# EAGLE design CanBus (EAGLE 7.4.0)

## Sheet 1 of 2
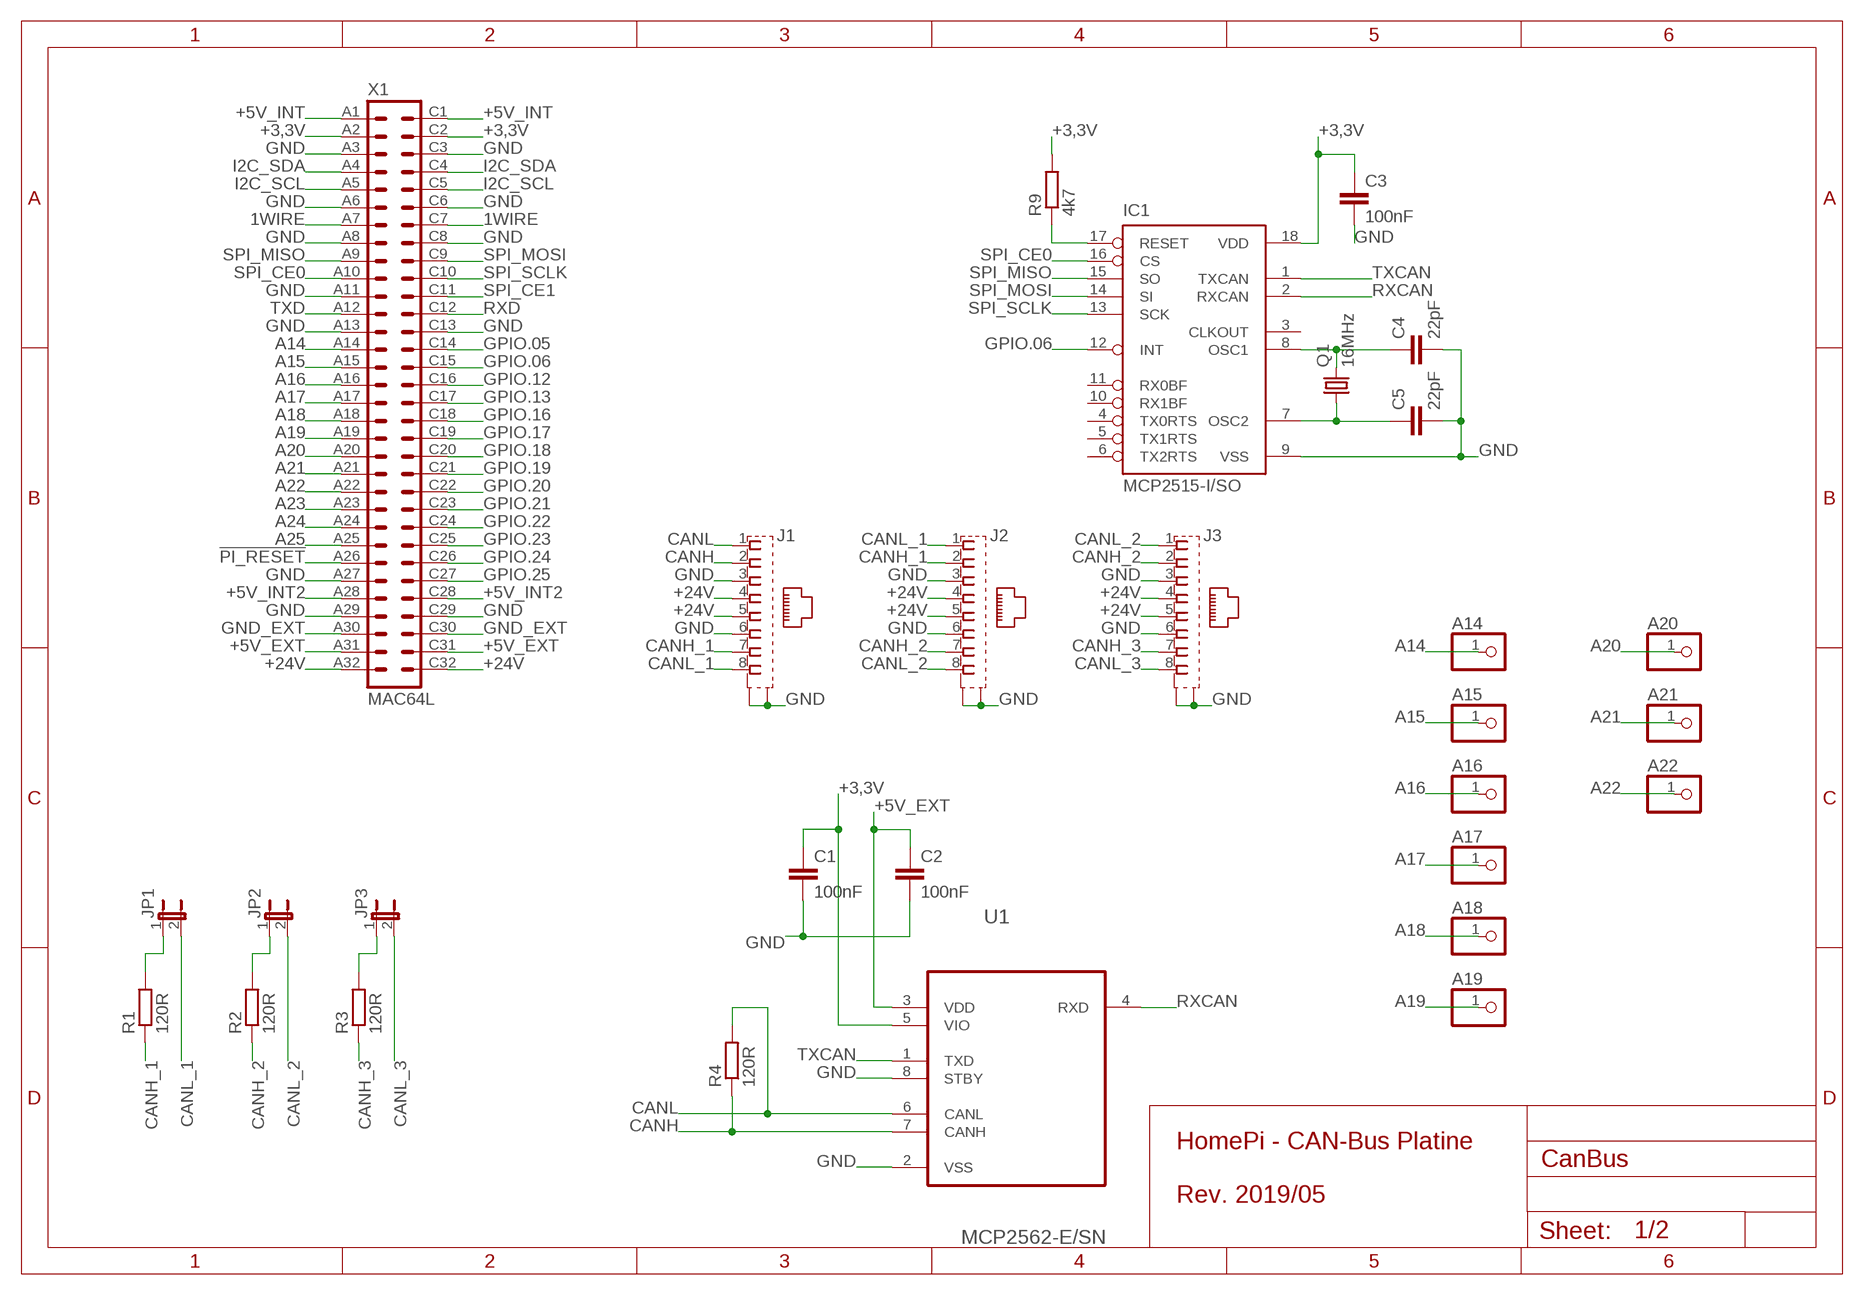
[diagram p0: schematic, sheet 1]

### Parts
A14  PINHD-1X1  [1X01]
A15  PINHD-1X1  [1X01]
A16  PINHD-1X1  [1X01]
A17  PINHD-1X1  [1X01]
A18  PINHD-1X1  [1X01]
A19  PINHD-1X1  [1X01]
A20  PINHD-1X1  [1X01]
A21  PINHD-1X1  [1X01]
A22  PINHD-1X1  [1X01]
C1  100nF  C-EUC1206  [C1206]
C2  100nF  C-EUC1206  [C1206]
C3  100nF  C-EUC1206  [C1206]
C4  22pF  C-EUC1206  [C1206]
C5  22pF  C-EUC1206  [C1206]
IC1  MCP2515-I/SO  [SO18L]
J1  555141-1  [MEBP_8-8G]
J2  555141-1  [MEBP_8-8G]
J3  555141-1  [MEBP_8-8G]
JP1  JP1E  [JP1]
JP2  JP1E  [JP1]
JP3  JP1E  [JP1]
Q1  16MHz  CRYSTALHC49UP  [HC49UP]
R1  120R  R-EU_R1206  [R1206]
R2  120R  R-EU_R1206  [R1206]
R3  120R  R-EU_R1206  [R1206]
R4  120R  R-EU_R1206  [R1206]
R9  4k7  R-EU_R1206  [R1206]
U1  MCP2562-E/SN  [SO08]
X1  MAC64L  [MAC64L]

### Nets
1WIRE: X1.A7 X1.C7
!PI_RESET: X1.A26 ; also sheet 2
+3,3V: C1.1 C3.1 IC1.18(VDD) R9.2 U1.5(VIO) X1.A2 X1.C2 ; also sheet 2
+5V_EXT: C2.1 U1.3(VDD) X1.A31 X1.C31 ; also sheet 2
+5V_INT: X1.A1 X1.C1
+5V_INT2: X1.A28 X1.C28
+24V [24V]: J1.4 J1.5 J2.4 J2.5 J3.4 J3.5 X1.A32 X1.C32
A14: A14.1 X1.A14
A15: A15.1 X1.A15
A16: A16.1 X1.A16
A17: A17.1 X1.A17
A18: A18.1 X1.A18
A19: A19.1 X1.A19
A20: A20.1 X1.A20
A21: A21.1 X1.A21
A22: A22.1 X1.A22
A23: X1.A23
A24: X1.A24
A25: X1.A25
CANH: J1.2 R4.1 U1.7(CANH) ; also sheet 2
CANH_1: J1.7 J2.2 R1.1
CANH_2: J2.7 J3.2 R2.1
CANH_3: J3.7 R3.1
CANL: J1.1 R4.2 U1.6(CANL) ; also sheet 2
CANL_1: J1.8 J2.1 JP1.2
CANL_2: J2.8 J3.1 JP2.2
CANL_3: J3.8 JP3.2
GND: C1.2 C2.2 C3.2 C4.2 C5.2 IC1.9(VSS) J1.3 J1.6 J1.G1(S1) J1.G2(S2) J2.3 J2.6 J2.G1(S1) J2.G2(S2) J3.3 J3.6 J3.G1(S1) J3.G2(S2) U1.2(VSS) U1.8(STBY) X1.A3 X1.A6 X1.A8 X1.A11 X1.A13 X1.A27 X1.A29 X1.C3 X1.C6 X1.C8 X1.C13 X1.C29 ; also sheet 2
GND_EXT: X1.A30 X1.C30
GPIO.05: X1.C14
GPIO.06: IC1.12(INT) X1.C15
GPIO.12: X1.C16
GPIO.13: X1.C17
GPIO.16: X1.C18
GPIO.17: X1.C19
GPIO.18: X1.C20
GPIO.19: X1.C21
GPIO.20: X1.C22
GPIO.21: X1.C23
GPIO.22: X1.C24
GPIO.23: X1.C25
GPIO.24: X1.C26
GPIO.25: X1.C27
I2C_SCL: X1.A5 X1.C5
I2C_SDA: X1.A4 X1.C4
N$1: C4.1 IC1.8(OSC1) Q1.2
N$2: IC1.17(RESET) R9.1
N$3: JP2.1 R2.2
N$4: C5.1 IC1.7(OSC2) Q1.1
N$8: JP1.1 R1.2
N$12: JP3.1 R3.2
RXCAN: IC1.2(RXCAN) U1.4(RXD)
RXD: X1.C12
SPI_CE0: IC1.16(CS) X1.A10
SPI_CE1: X1.C11
SPI_MISO: IC1.15(SO) X1.A9
SPI_MOSI: IC1.14(SI) X1.C9
SPI_SCLK: IC1.13(SCK) X1.C10
TXCAN: IC1.1(TXCAN) U1.1(TXD)
TXD: X1.A12
Unconnected: IC1.3(CLKOUT) IC1.4(TX0RTS) IC1.5(TX1RTS) IC1.6(TX2RTS) IC1.10(RX1BF) IC1.11(RX0BF)

### Notes on the sheet
- HomePi - CAN-Bus Platine
  
  Rev. 2019/05

## Sheet 2 of 2
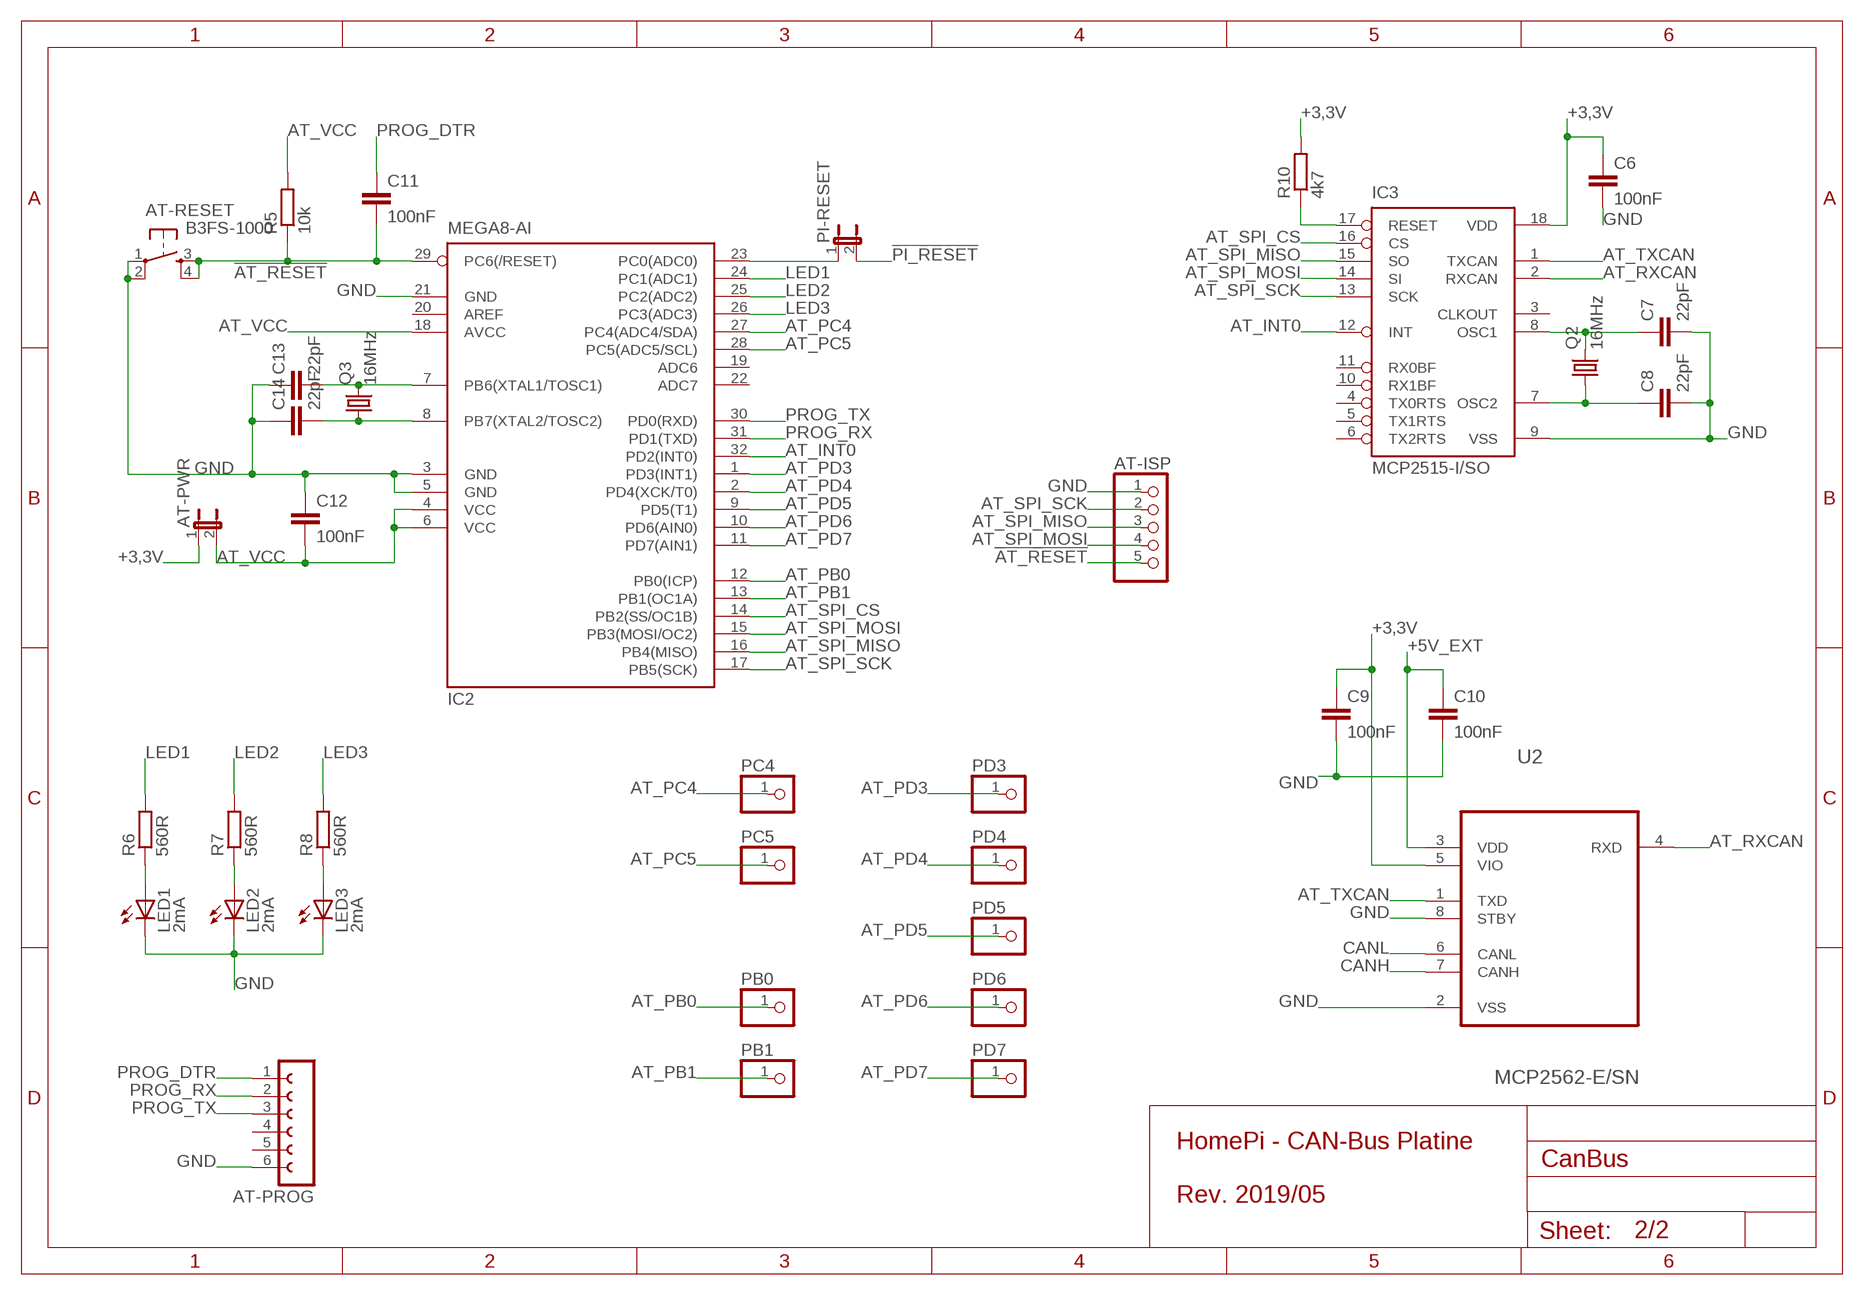
[diagram p1: schematic, sheet 2]

### Parts
AT-ISP  PINHD-1X5  [1X05]
AT-PROG  FE06W  [FE06W]
AT-PWR  JP1E  [JP1]
AT-RESET  B3FS-1000  [B3FS-1000]
C6  100nF  C-EUC1206  [C1206]
C7  22pF  C-EUC1206  [C1206]
C8  22pF  C-EUC1206  [C1206]
C9  100nF  C-EUC1206  [C1206]
C10  100nF  C-EUC1206  [C1206]
C11  100nF  C-EUC1206  [C1206]
C12  100nF  C-EUC1206  [C1206]
C13  22pF  C-EUC1206  [C1206]
C14  22pF  C-EUC1206  [C1206]
IC2  MEGA8-AI  [TQFP32-08]
IC3  MCP2515-I/SO  [SO18L]
LED1  2mA  LED3MM  [LED3MM]
LED2  2mA  LED3MM  [LED3MM]
LED3  2mA  LED3MM  [LED3MM]
PB0  PINHD-1X1  [1X01]
PB1  PINHD-1X1  [1X01]
PC4  PINHD-1X1  [1X01]
PC5  PINHD-1X1  [1X01]
PD3  PINHD-1X1  [1X01]
PD4  PINHD-1X1  [1X01]
PD5  PINHD-1X1  [1X01]
PD6  PINHD-1X1  [1X01]
PD7  PINHD-1X1  [1X01]
PI-RESET  JP1E  [JP1]
Q2  16MHz  CRYSTALHC49UP  [HC49UP]
Q3  16MHz  CRYSTALHC49UP  [HC49UP]
R5  10k  R-EU_R1206  [R1206]
R6  560R  R-EU_R1206  [R1206]
R7  560R  R-EU_R1206  [R1206]
R8  560R  R-EU_R1206  [R1206]
R10  4k7  R-EU_R1206  [R1206]
U2  MCP2562-E/SN  [SO08]

### Nets
!AT_RESET: AT-ISP.5 AT-RESET.3(S) AT-RESET.4(S1) C11.2 IC2.29(PC6(/RESET)) R5.1
!PI_RESET: PI-RESET.2 ; also sheet 1
+3,3V: AT-PWR.1 C6.1 C9.1 IC3.18(VDD) R10.2 U2.5(VIO) ; also sheet 1
+5V_EXT: C10.1 U2.3(VDD) ; also sheet 1
AT_INT0: IC2.32(PD2(INT0)) IC3.12(INT)
AT_PB0: IC2.12(PB0(ICP)) PB0.1
AT_PB1: IC2.13(PB1(OC1A)) PB1.1
AT_PC4: IC2.27(PC4(ADC4/SDA)) PC4.1
AT_PC5: IC2.28(PC5(ADC5/SCL)) PC5.1
AT_PD3: IC2.1(PD3(INT1)) PD3.1
AT_PD4: IC2.2(PD4(XCK/T0)) PD4.1
AT_PD5: IC2.9(PD5(T1)) PD5.1
AT_PD6: IC2.10(PD6(AIN0)) PD6.1
AT_PD7: IC2.11(PD7(AIN1)) PD7.1
AT_RXCAN: IC3.2(RXCAN) U2.4(RXD)
AT_SPI_CS: IC2.14(PB2(SS/OC1B)) IC3.16(CS)
AT_SPI_MISO: AT-ISP.3 IC2.16(PB4(MISO)) IC3.15(SO)
AT_SPI_MOSI: AT-ISP.4 IC2.15(PB3(MOSI/OC2)) IC3.14(SI)
AT_SPI_SCK: AT-ISP.2 IC2.17(PB5(SCK)) IC3.13(SCK)
AT_TXCAN: IC3.1(TXCAN) U2.1(TXD)
AT_VCC: AT-PWR.2 C12.2 IC2.4(VCC) IC2.6(VCC) IC2.18(AVCC) R5.2
CANH: U2.7(CANH) ; also sheet 1
CANL: U2.6(CANL) ; also sheet 1
GND: AT-ISP.1 AT-PROG.6 AT-RESET.1(P) AT-RESET.2(P1) C6.2 C7.2 C8.2 C9.2 C10.2 C12.1 C13.1 C14.1 IC2.3(GND) IC2.5(GND) IC2.21(GND) IC3.9(VSS) LED1.K(C) LED2.K(C) LED3.K(C) U2.2(VSS) U2.8(STBY) ; also sheet 1
LED1: IC2.24(PC1(ADC1)) R6.2
LED2: IC2.25(PC2(ADC2)) R7.2
LED3: IC2.26(PC3(ADC3)) R8.2
N$5: IC3.17(RESET) R10.1
N$6: C7.1 IC3.8(OSC1) Q2.2
N$7: C8.1 IC3.7(OSC2) Q2.1
N$9: IC2.23(PC0(ADC0)) PI-RESET.1
N$10: C13.2 IC2.7(PB6(XTAL1/TOSC1)) Q3.2
N$11: C14.2 IC2.8(PB7(XTAL2/TOSC2)) Q3.1
N$14: LED1.A R6.1
N$15: LED2.A R7.1
N$19: LED3.A R8.1
PROG_DTR: AT-PROG.1 C11.1
PROG_RX: AT-PROG.2 IC2.31(PD1(TXD))
PROG_TX: AT-PROG.3 IC2.30(PD0(RXD))
Unconnected: AT-PROG.4 AT-PROG.5 IC2.19(ADC6) IC2.20(AREF) IC2.22(ADC7) IC3.3(CLKOUT) IC3.4(TX0RTS) IC3.5(TX1RTS) IC3.6(TX2RTS) IC3.10(RX1BF) IC3.11(RX0BF)

### Notes on the sheet
- HomePi - CAN-Bus Platine
  
  Rev. 2019/05

## Library data of the parts
A14-A22 PB0 PB1 PC4 PC5 PD3-PD7 = pinhead:PINHD-1X1: PIN HEADER
AT-ISP = pinhead:PINHD-1X5: PIN HEADER
AT-PROG = con-lsta:FE06W: FEMALE HEADER; OC_FARNELL: unknown; OC_NEWARK: unknown
AT-PWR JP1-JP3 PI-RESET = jumper:JP1E: JUMPER
AT-RESET = b3fs-1000:B3FS-1000
C1-C14 = rcl:C-EU: CAPACITOR, European symbol
IC1 IC3 = mcp2515_2551_2562:MCP2515
IC2 = atmel:MEGA8: MICROCONTROLLER 8 Kbytes FLASH, 1 kbytes SRAM, 512 bytes EEPROM, USART, 6-channel 10 bit ADC, 2-channel 8 bit ADC Pin compatible with Atmega48, ATMega88, ATMega168 Source: avr.lbr; MPN: ATMEGA8-16AU; OC_FARNELL: 9171371; OC_NEWARK: 73M8863
J1-J3 = mebp_8-8g:555141-1: AMP connector Reichelt Bestell-Nr. MEBP 8-8G
LED1-LED3 = led:LED: LED OSRAM: - CHIPLED LG R971, LG N971, LY N971, LG Q971, LY Q971, LO R971, LY R971 LH N974, LH R974 LS Q976, LO Q976, LY Q976 LO Q996 - Hyper CHIPLED LW Q18S LB Q993, LB Q99A, LB R99A - SideLED LS A670, LO A670, LY A670, LG A670, LP A670 LB A673, LV A673, LT A673, LW A673 LH A674 LY A675 LS A676, LA A676, LO A676, LY A676, LW A676 LS A679, LY A679, LG A679 - Hyper Micro SIDELED® LS Y876, LA Y876, LO Y876, LY Y876 LT Y87S - SmartLED LW L88C, LW L88S LB L89C, LB L89S, LG L890 LS L89K, LO L89K, LY L89K LS L896, LA L896, LO L896, LY L896 - TOPLED LS T670, LO T670, LY T670, LG T670, LP T670 LSG T670, LSP T670, LSY T670, LOP T670, LYG T670 LG T671, LOG T671, LSG T671 LB T673, LV T673, LT T673, LW T673 LH T674 LS T676, LA T676, LO T676, LY T676, LB T676, LH T676, LSB T676, LW T676 LB T67C, LV T67C, LT T67C, LS T67K, LO T67K, LY T67K, LW E67C LS E67B, LA E67B, LO E67B, LY E67B, LB E67C, LV E67C, LT E67C LW T67C LS T679, LY T679, LG T679 LS T770, LO T770, LY T770, LG T770, LP T770 LB T773, LV T773, LT T773, LW T773 LH T774 LS E675, LA E675, LY E675, LS T675 LS T776, LA T776, LO T776, LY T776, LB T776 LHGB T686 LT T68C, LB T68C - Hyper Mini TOPLED® LB M676 - Mini TOPLED Santana® LG M470 LS M47K, LO M47K, LY M47K Source: http://www.osram.convergy.de LUXEON: - LUMILED® LXK2-PW12-R00, LXK2-PW12-S00, LXK2-PW14-U00, LXK2-PW14-V00 LXK2-PM12-R00, LXK2-PM12-S00, LXK2-PM14-U00 LXK2-PE12-Q00, LXK2-PE12-R00, LXK2-PE12-S00, LXK2-PE14-T00, LXK2-PE14-U00 LXK2-PB12-K00, LXK2-PB12-L00, LXK2-PB12-M00, LXK2-PB14-N00, LXK2-PB14-P00, LXK2-PB14-Q00 LXK2-PR12-L00, LXK2-PR12-M00, LXK2-PR14-Q00, LXK2-PR14-R00 LXK2-PD12-Q00, LXK2-PD12-R00, LXK2-PD12-S00 LXK2-PH12-R00, LXK2-PH12-S00 LXK2-PL12-P00, LXK2-PL12-Q00, LXK2-PL12-R00 Source: www.luxeon.com KINGBRIGHT: KA-3528ASYC Source: www.kingbright.com
Q1-Q3 = crystal:CRYSTAL: CRYSTAL; OC_FARNELL: unknown; OC_NEWARK: unknown
R1-R10 = rcl:R-EU_: RESISTOR, European symbol
U1 U2 = mcp2515_2551_2562:MCP2562: High-Speed CAN Transceiver,DIP-8
X1 = con-vg:MAC64L: CONNECTOR male, 64 pins, block, type C, rows AC, grid 5.08 mm

## Net classes
1 24V: width 0.813 mm, clearance 0.406 mm

## Board
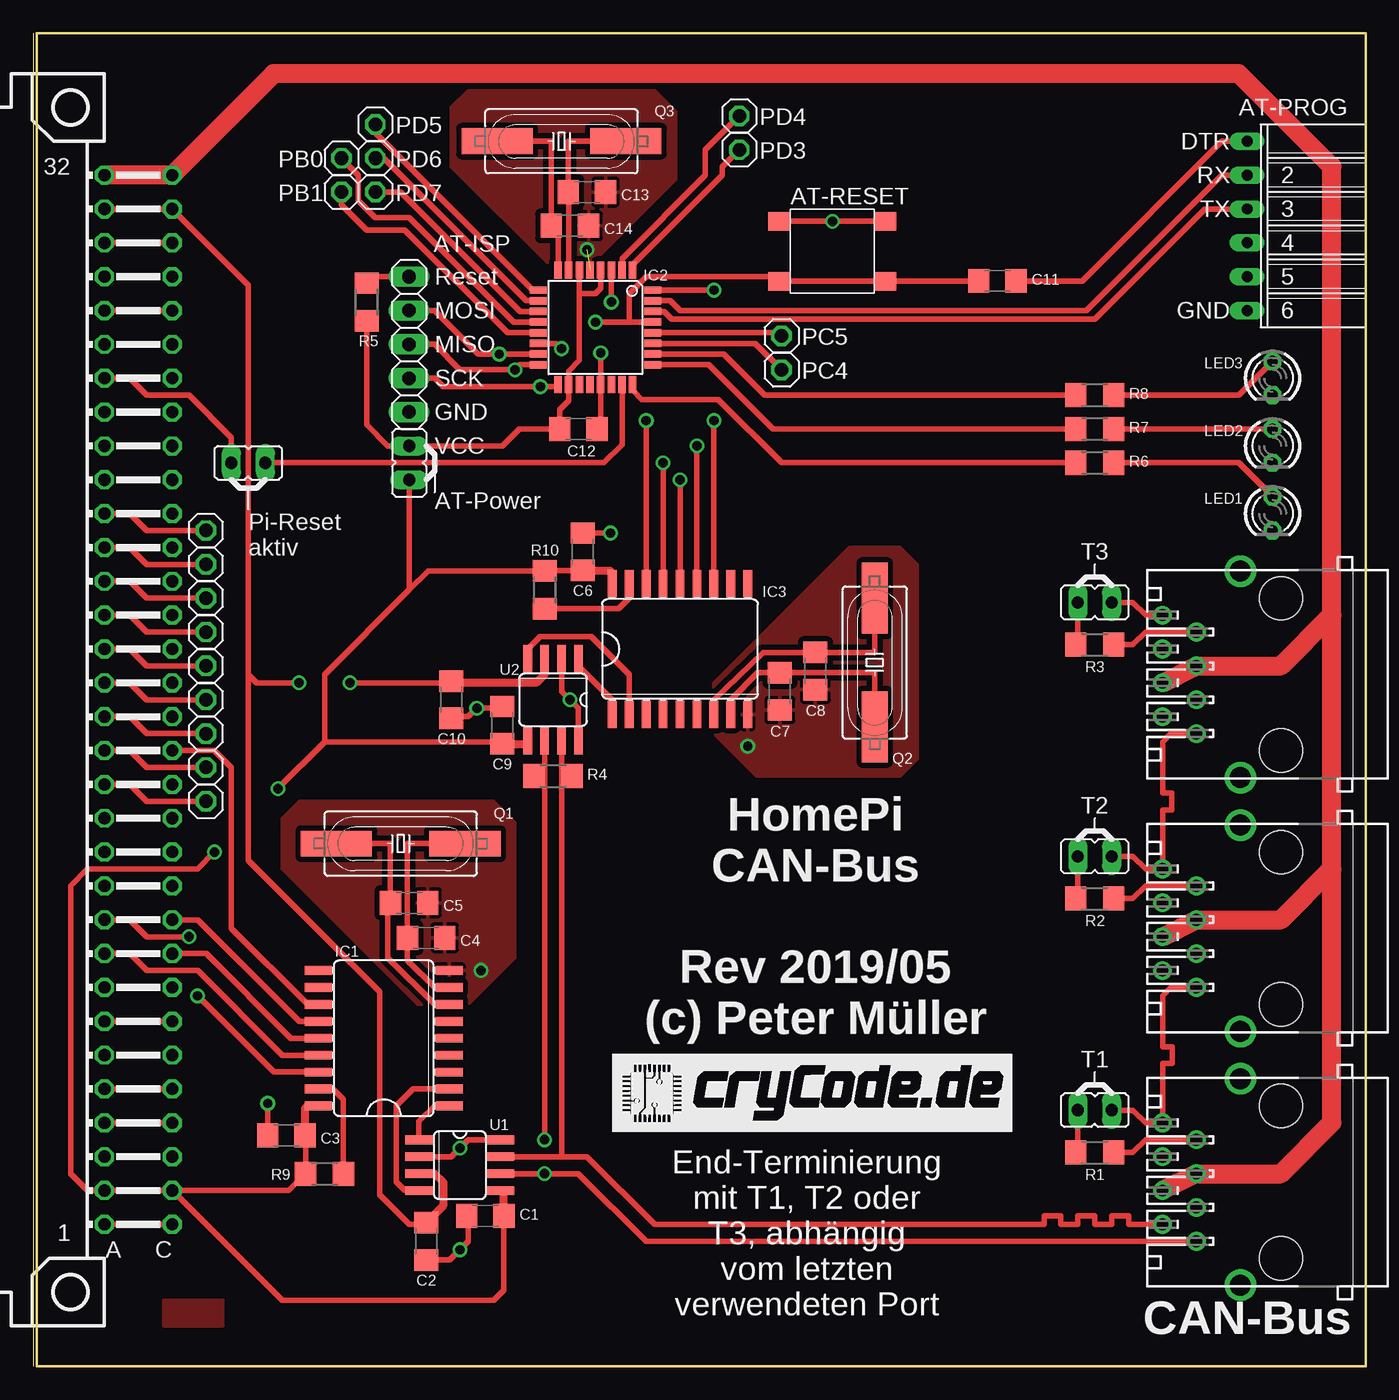
[diagram p2: board, top side]
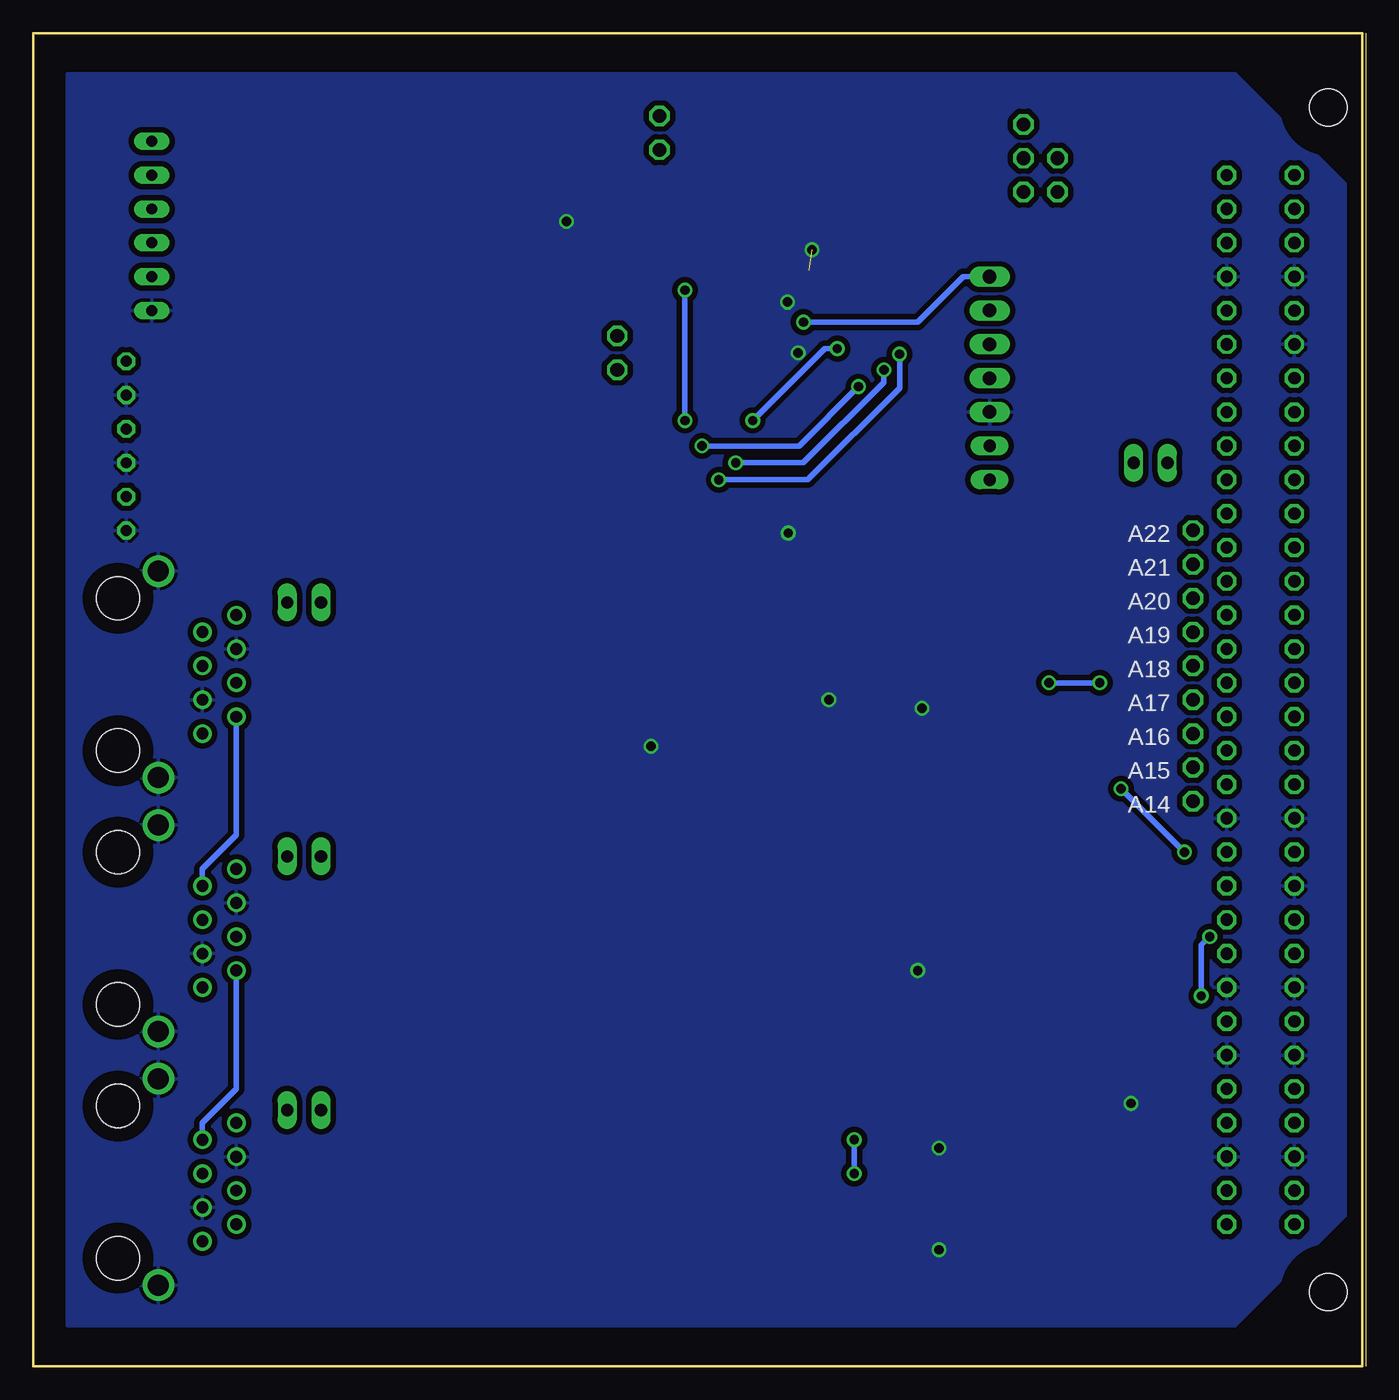
[diagram p3: board, bottom side, seen from below]

Size 99.69 x 100 mm. Coordinates in mm from the lower left corner, seen from the top.
Outline: 0,0 99.69,0 99.69,100 0,100 0,0
Copper layers (1*16): Top 0.035mm / dielectric 1.5mm / Bottom 0.035mm
Design rules "allpcb2": minimum track width 8mil, minimum drill 0.5mm, track to track 8mil, track to pad 8mil, pad to pad 8mil, via to via 8mil, smd to smd 6mil, copper to edge 40mil, drill to drill 8mil, minimum pad ring 10mil, minimum via ring 8mil, stop-mask expansion 0.1mm, vias tented up to drill 0mil, thermal gap 10mil

### Footprints (pad centres in the part's own frame; a part is rotated, then mirrored left to right if it is on the bottom)
1X01 = drill 1.016 octagon: 1 0,0
1X05 = drill 1.016 long: 1 -5.08,0; 2 -2.54,0; 3 0,0; 4 2.54,0; 5 5.08,0
FE06W = drill 0.813 long: 1 -6.35,0; 2 -3.81,0; 3 -1.27,0; 4 1.27,0; 5 3.81,0; 6 6.35,0
JP1 = drill 0.914 long: 1 0,-1.27; 2 0,1.27
B3FS-1000 = smd 1.6 x 1.4: 1 4,-2.25; 2 -4,-2.25; 3 4,2.25; 4 -4,2.25
C1206 = smd 1.6 x 1.8: 1 -1.4,0; 2 1.4,0
SO18L = smd 0.66 x 2.032: 1 -5.08,-4.902; 2 -3.81,-4.902; 3 -2.54,-4.902; 4 -1.27,-4.902; 5 0,-4.902; 6 1.27,-4.902; 7 2.54,-4.902; 8 3.81,-4.902; 9 5.08,-4.902; 10 5.08,4.902; 11 3.81,4.902; 12 2.54,4.902; 13 1.27,4.902; 14 0,4.902; 15 -1.27,4.902; 16 -2.54,4.902; 17 -3.81,4.902; 18 -5.08,4.902
TQFP32-08 = smd 1.27 x 0.559: 1 -4.293,2.8; 2 -4.293,2; 3 -4.293,1.2; 4 -4.293,0.4; 5 -4.293,-0.4; 6 -4.293,-1.2; 7 -4.293,-2; 8 -4.293,-2.8; 17 4.293,-2.8; 18 4.293,-2; 19 4.293,-1.2; 20 4.293,-0.4; 21 4.293,0.4; 22 4.293,1.2; 23 4.293,2; 24 4.293,2.8 | smd 0.559 x 1.27: 9 -2.8,-4.293; 10 -2,-4.293; 11 -1.2,-4.293; 12 -0.4,-4.293; 13 0.4,-4.293; 14 1.2,-4.293; 15 2,-4.293; 16 2.8,-4.293; 25 2.8,4.293; 26 2,4.293; 27 1.2,4.293; 28 0.4,4.293; 29 -0.4,4.293; 30 -1.2,4.293; 31 -2,4.293; 32 -2.8,4.293
MEBP_8-8G = drill 0.889: 1 -4.445,6.35; 2 -3.175,8.89; 3 -1.905,6.35; 4 -0.635,8.89; 5 0.635,6.35; 6 1.905,8.89; 7 3.175,6.35; 8 4.445,8.89 | drill 1.575 pad 2.184: G1 -7.745,3.05; G2 7.745,3.05 | hole 3.251: -5.715,0; 5.715,0
LED3MM = drill 0.813 octagon: A -1.27,0; K 1.27,0
HC49UP = smd 5.334 x 1.93: 1 -4.826,0; 2 4.826,0
R1206 = smd 1.6 x 1.803: 1 -1.422,0; 2 1.422,0
SO08 = smd 0.66 x 2.032: 1 -1.905,-3.073; 2 -0.635,-3.073; 3 0.635,-3.073; 4 1.905,-3.073; 5 1.905,3.073; 6 0.635,3.073; 7 -0.635,3.073; 8 -1.905,3.073
MAC64L = drill 0.914 octagon: A1 -2.54,39.37; A2 -2.54,36.83; A3 -2.54,34.29; A4 -2.54,31.75; A5 -2.54,29.21; A6 -2.54,26.67; A7 -2.54,24.13; A8 -2.54,21.59; A9 -2.54,19.05; A10 -2.54,16.51; A11 -2.54,13.97; A12 -2.54,11.43; A13 -2.54,8.89; A14 -2.54,6.35; A15 -2.54,3.81; A16 -2.54,1.27; A17 -2.54,-1.27; A18 -2.54,-3.81; A19 -2.54,-6.35; A20 -2.54,-8.89; A21 -2.54,-11.43; A22 -2.54,-13.97; A23 -2.54,-16.51; A24 -2.54,-19.05; A25 -2.54,-21.59; A26 -2.54,-24.13; A27 -2.54,-26.67; A28 -2.54,-29.21; A29 -2.54,-31.75; A30 -2.54,-34.29; A31 -2.54,-36.83; A32 -2.54,-39.37; C1 -7.62,39.37; C2 -7.62,36.83; C3 -7.62,34.29; C4 -7.62,31.75; C5 -7.62,29.21; C6 -7.62,26.67; C7 -7.62,24.13; C8 -7.62,21.59; C9 -7.62,19.05; C10 -7.62,16.51; C11 -7.62,13.97; C12 -7.62,11.43; C13 -7.62,8.89; C14 -7.62,6.35; C15 -7.62,3.81; C16 -7.62,1.27; C17 -7.62,-1.27; C18 -7.62,-3.81; C19 -7.62,-6.35; C20 -7.62,-8.89; C21 -7.62,-11.43; C22 -7.62,-13.97; C23 -7.62,-16.51; C24 -7.62,-19.05; C25 -7.62,-21.59; C26 -7.62,-24.13; C27 -7.62,-26.67; C28 -7.62,-29.21; C29 -7.62,-31.75; C30 -7.62,-34.29; C31 -7.62,-36.83; C32 -7.62,-39.37 | hole 2.794: 0,44.45; 0,-44.45

### Placement (x,y rotation side)
A14  12.7,42.38 180 top
A15  12.7,44.92 180 top
A16  12.7,47.46 180 top
A17  12.7,50 180 top
A18  12.7,52.54 180 top
A19  12.7,55.08 180 top
A20  12.7,57.62 180 top
A21  12.7,60.16 180 top
A22  12.7,62.7 180 top
AT-ISP  27.94,76.67 90 top
AT-PROG  90.81,85.56 270 top
AT-PWR  27.94,67.78 0 top
AT-RESET  59.69,83.66 180 top
C1  33.66,11.27 180 top
C2  29.21,9.36 270 top
C3  18.73,17.3 180 top
C4  29.21,32.13 0 top
C5  27.94,34.76 0 top
C6  40.96,61.11 90 top
C7  55.75,50.63 270 top
C8  58.42,52.16 270 top
C9  34.92,48.09 90 top
C10  31.11,50 270 top
C11  72.07,81.43 180 top
C12  40.64,70.32 180 top
C13  41.27,88.1 180 top
C14  40.01,85.56 180 top
IC1  26.04,24.6 90 top
IC2  41.91,77.94 270 top
IC3  48.26,53.81 0 top
J1  93.34,13.81 90 top
J2  93.34,32.85 90 top
J3  93.34,51.91 90 top
JP1  79.38,19.2 270 top
JP2  79.38,38.25 270 top
JP3  79.38,57.3 270 top
LED1  92.71,63.97 270 top
LED2  92.71,69.05 270 top
LED3  92.71,74.13 270 top
PB0  22.86,90.64 0 top
PB1  22.86,88.1 0 top
PC4  55.88,74.77 0 top
PC5  55.88,77.3 0 top
PD3  52.7,91.28 0 top
PD4  52.7,93.81 0 top
PD5  25.4,93.18 0 top
PD6  25.4,90.64 0 top
PD7  25.4,88.1 0 top
PI-RESET  15.88,67.78 90 top
Q1  27.3,39.2 0 top
Q2  62.87,52.79 270 top
Q3  39.37,91.91 0 top
R1  79.38,16.03 180 top
R2  79.38,35.08 180 top
R3  79.38,54.13 180 top
R4  38.73,44.28 180 top
R5  24.77,79.84 270 top
R6  79.38,67.78 180 top
R7  79.38,70.32 180 top
R8  79.38,72.86 180 top
R9  21.59,14.44 180 top
R10  38.1,58.25 90 top
U1  31.75,15.08 270 top
U2  38.73,50 180 top
U$1  [30MM]  43.18,17.61 0 top
X1  2.54,50 180 top

### Tracks (layer width: path | path; a pad name or v marks a point on that pad's centre or on a via)
1WIRE
  Top 0.406: X1.A7 X1.C7
!AT_RESET  (via drill 0.7)
  Top 0.406: IC2.29 44.45,78.34 | 44.45,78.34 v41.91,78.34 | R5.1 24.77,81.75 AT-ISP.5 | 63.66,81.41 AT-RESET.3 55.59,81.41 55.24,81.75 45.72,81.75 44.45,80.48 44.45,78.34 | AT-RESET.4 63.66,81.41 | 63.66,81.41 C11.2
  Bottom 0.406: v41.91,78.34 33.34,78.34 29.93,81.75 AT-ISP.5
!PI_RESET
  Top 0.406: X1.A26 6.99,74.13 8.26,72.86 11.43,72.86 14.61,69.69 PI-RESET.2
+3,3V  (via drill 0.7)
  Top 0.406: X1.C2 X1.A2 3.81,13.17 2.54,14.44 2.54,36.03 3.81,37.3 12.06,37.3 v13.34,38.57 | 36.6,46.7 U2.5 | C9.1 34.92,46.82 21.59,46.82 | C1.1 35.05,5.68 34.29,4.92 18.41,4.92 X1.C2 | 35.05,12.94 U1.5 | X1.C2 18.9,13.17 R9.2 20.17,17.26 C3.1 | 21.59,46.82 v18.1,43.33 | 41.3,59.69 41.27,59.71 C6.1 38.14,59.71 R10.2 29.36,59.68 27.94,58.25 | AT-PWR.1 27.94,58.25 | 21.59,46.82 21.59,51.91 27.94,58.25
  Top 0.61: C9.1 36.6,46.7 | C1.1 35.05,12.94 | C3.1 20.13,19.33 20.32,19.52 IC1.18 | 41.3,59.69 43.01,59.69 43.18,59.52 IC3.18
  Bottom 0.406: v18.1,43.33 v13.34,38.57
+5V_EXT  (via drill 0.7)
  Top 0.406: X1.A31 X1.C31 15.88,81.11 15.88,51.91 | v19.68,51.27 16.51,51.27 15.88,51.91 | 31.25,51.27 C10.1 30.98,51.27 v23.5,51.27 | 15.88,51.91 15.88,37.94 25.72,28.09 25.72,12.85 27.94,10.63 29.08,10.63 C2.1
  Top 0.61: U2.3 38.1,51.91 37.47,51.27 31.25,51.27 | U1.3 29.84,14.44 30.48,13.81 30.48,12.03 C2.1
  Bottom 0.406: v19.68,51.27 v23.5,51.27
+5V_INT
  Top 0.406: X1.C1 X1.A1
+5V_INT2
  Top 0.406: X1.C28 X1.A28
+24V
  Top 1.422: J1.4 J1.5 93.34,14.44 97.16,18.25 97.16,37.3 | X1.A32 X1.C32 17.78,96.99 90.17,96.99 97.16,90 97.16,56.35 | 97.16,37.3 97.16,56.35 | J2.4 J2.5 93.34,33.49 97.16,37.3 | J3.4 J3.5 93.34,52.54 97.16,56.35
A14
  Top 0.406: X1.A14 6.99,43.65 8.26,42.38 A14.1
A15
  Top 0.406: X1.A15 6.99,46.19 8.26,44.92 A15.1
A16
  Top 0.406: X1.A16 6.99,48.73 8.26,47.46 A16.1
A17
  Top 0.406: X1.A17 6.99,51.27 8.26,50 A17.1
A18
  Top 0.406: X1.A18 6.99,53.81 8.26,52.54 A18.1
A19
  Top 0.406: X1.A19 6.99,56.35 8.26,55.08 A19.1
A20
  Top 0.406: X1.A20 6.99,58.89 8.26,57.62 A20.1
A21
  Top 0.406: X1.A21 6.99,61.43 8.26,60.16 A21.1
A22
  Top 0.406: X1.A22 6.99,63.97 8.26,62.7 A22.1
AT_INT0  (via drill 0.7)
  Top 0.406: IC2.32 v50.8,80.74 | IC3.12 v50.8,70.95
  Bottom 0.406: v50.8,70.95 v50.8,80.74
AT_PB0
  Top 0.406: IC2.12 35.8,78.34 27.94,86.19 25.4,86.19 24.13,87.47 24.13,89.37 PB0.1
AT_PB1
  Top 0.406: IC2.13 35.33,77.54 27.62,85.24 24.77,85.24 22.86,87.15 PB1.1
AT_PC4
  Top 0.406: IC2.27 53.91,76.74 PC4.1
AT_PC5
  Top 0.406: IC2.28 55.65,77.54 PC5.1
AT_PD3
  Top 0.406: IC2.1 44.71,82.64 51.44,89.37 51.44,90 PD3.1
AT_PD4
  Top 0.406: IC2.2 43.91,83.11 50.16,89.37 50.16,91.28 PD4.1
AT_PD5
  Top 0.406: IC2.9 37.2,80.74 25.4,92.55 PD5.1
AT_PD6
  Top 0.406: IC2.10 36.73,79.94 26.04,90.64 PD6.1
AT_PD7
  Top 0.406: IC2.11 36.27,79.14 27.3,88.1 PD7.1
AT_RXCAN
  Top 0.406: IC3.2 44.45,51.91 41.59,54.76 37.78,54.76 36.83,53.81 U2.4
AT_SPI_CS  (via drill 0.7)
  Top 0.406: IC3.16 v45.72,70.95 | IC2.14 38.98,76.74 v39.37,76.35
  Bottom 0.406: v39.37,76.35 40.32,76.35 v45.72,70.95
AT_SPI_MISO  (via drill 0.7)
  Top 0.406: IC3.15 v46.99,67.78 | IC2.16 36.25,75.14 v35.88,74.77 31.75,74.77 29.84,76.67 AT-ISP.3
  Bottom 0.406: v46.99,67.78 41.91,67.78 35.88,73.81 v35.88,74.77
AT_SPI_MOSI  (via drill 0.7)
  Top 0.406: IC3.14 v48.26,66.51 | IC2.15 v34.7,75.94 33.12,75.94 29.84,79.21 AT-ISP.4
  Bottom 0.406: v48.26,66.51 41.59,66.51 34.7,73.4 v34.7,75.94
AT_SPI_SCK  (via drill 0.7)
  Top 0.406: IC3.13 v49.53,69.05 | IC2.17 38.96,73.5 v37.78,73.5 30.48,73.5 29.84,74.13 AT-ISP.2
  Bottom 0.406: v49.53,69.05 42.23,69.05 v37.78,73.5
AT_TXCAN
  Top 0.406: IC3.1 43.18,50 40.64,52.54 U2.1
AT_VCC
  Top 0.406: IC2.6 40.71,80.48 | 40.71,80.48 40.71,75.47 39.91,74.67 IC2.18 39.91,72.45 39.24,71.78 C12.2 36.2,70.32 34.92,69.05 AT-PWR.2 26.35,69.05 24.77,70.64 R5.2 | IC2.4 42.31,80.88 41.91,80.48 40.71,80.48
CANH
  Top 0.406: 39.37,15.71 U1.7 | U2.7 39.37,44.28 | 39.37,44.28 39.37,15.71 | R4.1 39.37,44.28 | 39.37,15.71 41.27,15.71 46.35,10.63 75.56,10.63 75.56,11.27 76.83,11.27 76.83,10.63 78.11,10.63 78.11,11.27 79.38,11.27 79.38,10.63 80.64,10.63 80.64,11.27 81.92,11.27 81.92,10.63 J1.2
CANH_1
  Top 0.406: J1.7 83.19,16.98 82.23,16.03 R1.1
  Bottom 0.406: J2.2 84.45,20.79 87,18.25 J1.7
CANH_2
  Top 0.406: J2.7 83.19,36.03 82.23,35.08 R2.1
  Bottom 0.406: J3.2 84.45,39.84 87,37.3 J2.7
CANH_3
  Top 0.406: R3.1 82.23,54.13 83.19,55.08 J3.7
CANL  (via drill 0.7)
  Top 0.406: U1.6 v38.1,14.44 40.64,14.44 45.72,9.36 J1.1 | U2.6 38.1,44.28 | 38.1,44.28 v38.1,16.98 | R4.2 38.1,44.28
  Bottom 0.406: v38.1,16.98 v38.1,14.44
CANL_1
  Top 0.406: J2.1 85.09,28.41 84.45,27.77 84.45,23.96 85.17,23.96 85.17,22.7 84.45,22.7 J1.8 83.19,18.25 82.23,19.2 JP1.2
CANL_2
  Top 0.406: JP2.2 82.23,38.25 83.19,37.3 J2.8 84.45,41.74 85.17,41.74 85.17,43.02 84.45,43.02 84.45,46.82 85.09,47.46 J3.1
CANL_3
  Top 0.406: J3.8 83.19,56.35 82.23,57.3 JP3.2
GND  (via drill 0.7)  (1 unrouted)
  Top 0.406: C12.1 42.31,70.69 IC2.21 v42.31,76.03 | AT-RESET.2 v59.69,85.91 AT-RESET.1 | C9.2 34.8,49.37 v33.02,49.37 32.38,48.73 31.25,48.73 C10.2 | C6.2 v43.05,62.51 | U2.2 39.37,50.63 v40.01,50 40.64,49.37 U2.8 | IC2.3 v43.11,79.84 | C3.2 v17.33,19.71 | C1.2 32.38,11.13 32.38,9.36 v31.75,8.73 30.98,7.96 C2.2 | U1.2 31.11,15.71 v31.75,16.34 32.38,16.98 U1.8
  other vias: 41.27,83.77 53.34,46.51 33.34,29.68
  pour Bottom (isolate 0.406): 9.53,96.99 97.16,96.99 97.16,3.01 9.53,3.01 1.27,11.27 1.27,88.73
  pour Top (isolate 0.406): 38.73,82.39 31.11,90 31.11,94.45 32.38,95.72 46.35,95.72 47.94,94.13 47.94,89.05 41.27,82.39
  pour Top (isolate 0.406): 50.8,51.27 60.96,61.43 64.77,61.43 66.04,60.16 66.04,45.55 64.77,44.28 53.98,44.28 50.8,47.46
  pour Top (isolate 0.406): 28.57,27.14 18.41,37.3 18.41,41.11 19.68,42.38 34.29,42.38 35.88,40.79 35.88,30.63 32.38,27.14
  pour Bottom: 9.53,4.92 13.97,4.92 13.97,3.01 9.53,3.01
GND_EXT
  Top 0.406: X1.C30 X1.A30
GPIO.06
  Top 0.406: IC1.12 20.32,27.14 14.61,32.85 14.61,44.92 13.34,46.19 X1.C15
I2C_SCL
  Top 0.406: X1.C5 X1.A5
I2C_SDA
  Top 0.406: X1.A4 X1.C4
LED1
  Top 0.406: R6.2 55.88,67.78 51.12,72.54 45.4,72.54 44.71,73.23 IC2.24
LED2
  Top 0.406: R7.2 55.24,70.32 50.42,75.14 IC2.25
LED3
  Top 0.406: R8.2 54.61,72.86 51.53,75.94 IC2.26
N$1
  Top 0.406: Q1.2 27.81,39.2 C4.1 27.81,30.45 29.84,28.41 IC1.8
N$2
  Top 0.406: R9.1 23.01,20 22.23,20.79 IC1.17
N$3
  Top 0.406: R2.2 78.11,35.39 JP2.1
N$4
  Top 0.406: Q1.1 26.54,39.2 C5.1 26.35,34.76 26.35,30.63 29.84,27.14 IC1.7
N$5
  Top 0.406: R10.1 43.66,56.83 44.45,57.62 IC3.17
N$6
  Top 0.406: IC3.8 52.07,50 54.1,52.03 C7.1 62.87,52.03 Q2.2
N$7
  Top 0.406: IC3.7 50.8,50 54.49,53.56 C8.1 62.87,53.56 Q2.1
N$8
  Top 0.406: R1.2 78.11,16.34 JP1.1
N$9
  Top 0.406: IC2.23 43.91,69.14 42.55,67.78 PI-RESET.1
N$10
  Top 0.406: Q3.2 39.88,91.91 C13.2 39.91,88.1 IC2.7
N$11
  Top 0.406: Q3.1 38.6,91.91 C14.2 39.11,85.56 IC2.8
N$12
  Top 0.406: JP3.1 78.11,54.6 R3.2
N$14
  Top 0.406: R6.1 90.17,67.78 LED1.A
N$15
  Top 0.406: R7.1 LED2.A
N$19
  Top 0.406: R8.1 90.17,72.86 LED3.A
PROG_DTR
  Top 0.406: C11.1 78.42,81.43 88.9,91.91 AT-PROG.1
PROG_RX
  Top 0.406: AT-PROG.2 88.9,89.37 78.74,79.21 48.26,79.21 47.53,79.94 IC2.31
PROG_TX
  Top 0.406: AT-PROG.3 87.63,86.83 79.38,78.58 47.62,78.58 47.06,79.14 IC2.30
RXCAN
  Top 0.406: IC1.2 28.26,20.79 26.99,19.52 26.99,13.81 27.62,13.17 U1.4
SPI_CE0  (via drill 0.7)
  Top 0.406: X1.A10 6.99,33.49 8.26,32.22 v11.43,32.22 | v12.06,27.77 17.78,22.06 IC1.16
  Bottom 0.406: v11.43,32.22 12.06,31.58 v12.06,27.77
SPI_MISO
  Top 0.406: X1.A9 6.99,30.95 8.26,29.68 12.06,29.68 18.41,23.33 IC1.15
SPI_MOSI
  Top 0.406: X1.C9 12.7,30.95 19.05,24.6 IC1.14
SPI_SCLK
  Top 0.406: X1.C10 12.06,33.49 19.68,25.87 IC1.13
TOP
  pour Top: 9.53,4.92 13.97,4.92 13.97,3.01 9.53,3.01
TXCAN
  Top 0.406: U1.1 28.68,18.35 29.84,19.52 IC1.1

### Text on the board
tNames: DTR | RX | TX | Reset | GND | MOSI | MISO | SCK | GND | VCC | AT-Power | Pi-Reset / aktiv | T3 | T2 | HomePi / CAN-Bus / / Rev 2019/05 / (c) Peter Müller | T1 | End-Terminierung / mit T1, T2 oder / T3, abhängig / vom letzten / verwendeten Port | CAN-Bus
tRestrict: TOP
bRestrict: BOT